# EAGLE design USBHostShield-Rev2 (EAGLE 6.4)
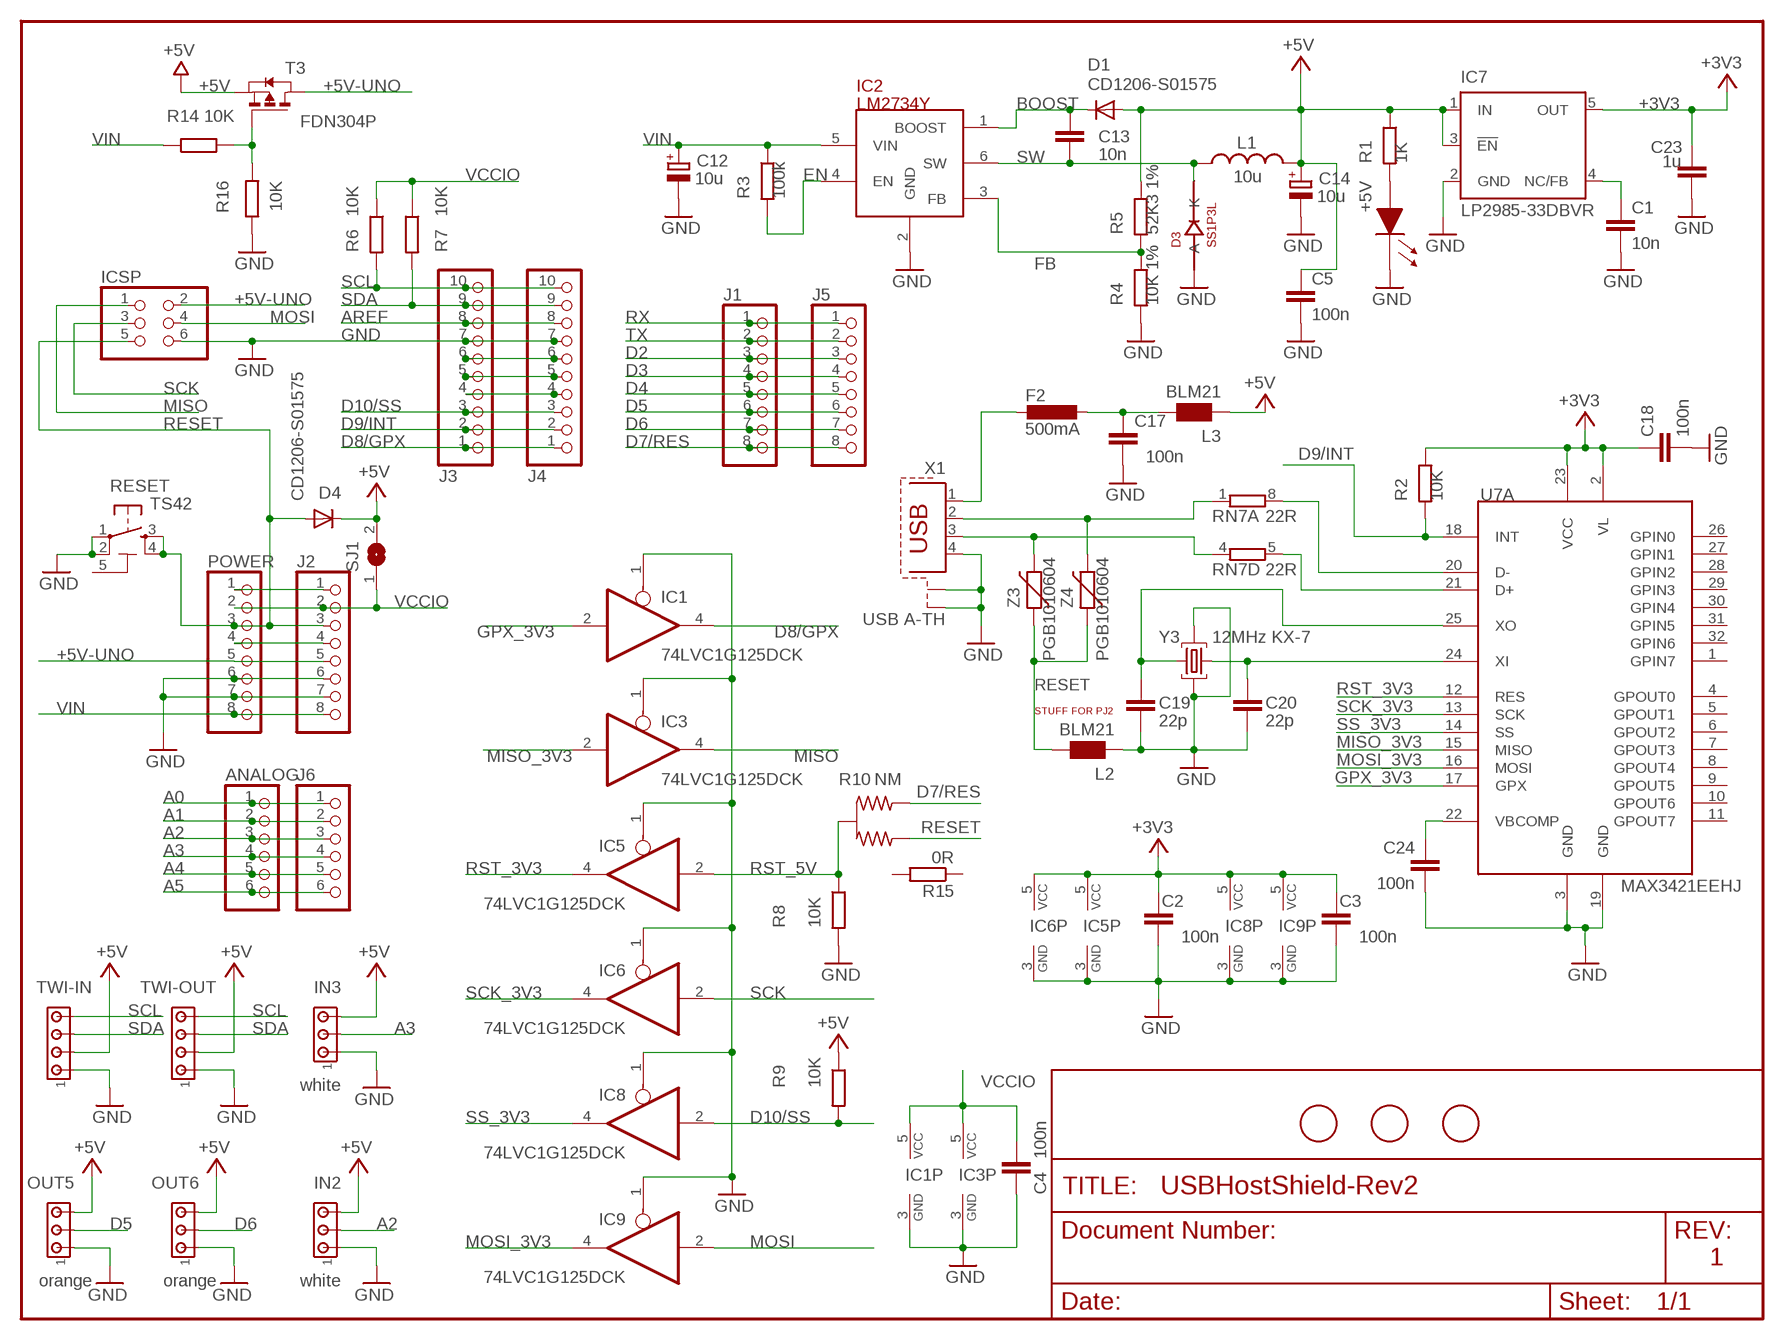
[diagram p0: schematic, sheet 1]

## Parts
+5V  MYSMD_LED0805  [SMD_LED0805]
ANALOG  PINHD-1X6TH  [1X06-TH]
C1  10n  C-EUC0603  [C0603-ROUND]
C2  100n  C-EU0603-RND  [C0603-ROUND]
C3  100n  C-EU0603-RND  [C0603-ROUND]
C4  100n  C-EU0603-RND  [C0603-ROUND]
C5  100n  C-EU0603-RND  [C0603-ROUND]
C12  10u  CPOL-EUSMCB  [SMC_B]
C13  10n  C-EUC0603  [C0603-ROUND]
C14  10u  CPOL-EUSMCB  [SMC_B]
C17  100n  C-EU0603-RND  [C0603-ROUND]
C18  100n  C-EU0603-RND  [C0603-ROUND]
C19  22p  C-EU0603-RND  [C0603-ROUND]
C20  22p  C-EU0603-RND  [C0603-ROUND]
C23  1u  C-EU0603-RND  [C0603-ROUND]
C24  100n  C-EU0603-RND  [C0603-ROUND]
D1  CD1206-S01575  DIODE-MINIMELF  [MINIMELF]
D3  SS1P3L  [DO220AAL]
D4  CD1206-S01575  DIODE-MINIMELF  [MINIMELF]
F2  500mA  L-EUL1812  [L1812]
IC1  74LVC1G125DCK  [SC70-5]
IC2  LM2734Y  LM2736Y  [SOT23-6]
IC3  74LVC1G125DCK  [SC70-5]
IC5  74LVC1G125DCK  [SC70-5]
IC6  74LVC1G125DCK  [SC70-5]
IC7  LP2985-33DBVR  TPS77033  [SOT23-DBV]
IC8  74LVC1G125DCK  [SC70-5]
IC9  74LVC1G125DCK  [SC70-5]
ICSP  PINHD-2X3  [2X03]
IN2  white  0141_LHA-03-TS  [10X03MTA]
IN3  white  0141_LHA-03-TS  [10X03MTA]
J1  PINHD-1X8TH  [1X08-TH]
J2  PINHD-1X8TH  [1X08-TH]
J3  PINHD-1X10TH  [1X10-TH]
J4  PINHD-1X10TH  [1X10-TH]
J5  PINHD-1X8TH  [1X08-TH]
J6  PINHD-1X6TH  [1X06-TH]
L1  10u  L-USSRR0604  [SRR0604]
L2  BLM21  WE-CBF_0805  [0805]
L3  BLM21  WE-CBF_0805  [0805]
OUT5  orange  0481_LHA-03-TS-P1585C  [10X03MTA]
OUT6  orange  0481_LHA-03-TS-P1585C  [10X03MTA]
POWER  PINHD-1X8TH  [1X08-TH]
R1  1K  R-EU_0603-RND  [R0603-ROUND]
R2  10K  R-EU_0603-RND  [R0603-ROUND]
R3  100k  R-EU_0603-RND  [R0603-ROUND]
R4  10K 1%  R-EU_0603-RND  [R0603-ROUND]
R5  52K3 1%  R-EU_0603-RND  [R0603-ROUND]
R6  10K  R-EU_0603-RND  [R0603-ROUND]
R7  10K  R-EU_0603-RND  [R0603-ROUND]
R8  10K  R-EU_0603-RND  [R0603-ROUND]
R9  10K  R-EU_0603-RND  [R0603-ROUND]
R10  NM  J0402  [J0402]
R14  10K  R-EU_0603-RND  [R0603-ROUND]
R15  0R  R-EU_R0402  [R0402]
R16  10K  R-EU_0603-RND  [R0603-ROUND]
RESET  TS42  [TS42]
RN7  22R  4R-NCAY16  [CAY16]
SJ1  SJ  [SJ]
T3  FDN304P  PMOSSOT23  [SOT-23]
TWI-IN  0205_LHA-04-TS__4X1_VERTICALE_BIANCO_P_2,54  [10X04MTA]
TWI-OUT  0205_LHA-04-TS__4X1_VERTICALE_BIANCO_P_2,54  [10X04MTA]
U7A  MAX3421EEHJ  [TQFP32-05]
U$1  FIDUCIALMOUNT  [FIDUCIA-MOUNT]
U$3  FIDUCIALMOUNT  [FIDUCIA-MOUNT]
U$6  FIDUCIALMOUNT  [FIDUCIA-MOUNT]
X1  USB A-TH  PN87520-S  [PN87520-S]
Y3  12MHz KX-7  CRYSTAL-3.2-2.5  [CRYSTAL-3.2-2.5]
Z3  PGB1010604  VARISTORCN0603  [CT/CN0603]
Z4  PGB1010604  VARISTORCN0603  [CT/CN0603]

## Nets
+3V3 [power]: C2.1 C3.1 C18.1 C23.2 IC5.5(VCC) IC6.5(VCC) IC7.5(OUT) IC8.5(VCC) IC9.5(VCC) R2.1 U7A.2(VL) U7A.23(VCC)
+5V [+5v]: C5.1 C14.+ D1.A D4.C IC7.1(IN) IC7.3(!EN) IN2.3 IN3.3 L1.P$2 L3.1 OUT5.3 OUT6.3 R1.1 R5.1 R9.1 SJ1.2 T3.2(S) TWI-IN.2 TWI-OUT.2
+5V-UNO [power]: ICSP.2 J2.5 POWER.5 T3.1(D)
A0: ANALOG.1 J6.1
A1: ANALOG.2 J6.2
A2: ANALOG.3 IN2.2 J6.3
A3: ANALOG.4 IN3.2 J6.4
A4: ANALOG.5 J6.5
A5: ANALOG.6 J6.6
AREF: J3.8 J4.8
BOOST: C13.1 D1.C IC2.1(BOOST)
D2: J1.3 J5.3
D3: J1.4 J5.4
D4: J1.5 J5.5
D5: J1.6 J5.6 OUT5.2
D6: J1.7 J5.7 OUT6.2
D7/RES: J1.8 J5.8 R10.1
D8/GPX: IC1.4(O) J3.1 J4.1
D9/INT: J3.2 J4.2 R2.2 U7A.18(INT)
D10/SS: IC8.2(I) J3.3 J4.3 R9.2
EN: IC2.4(EN) R3.2
FB: IC2.3(FB) R4.1 R5.2
GND [gnd]: +5V.1(CA) C1.2 C2.2 C3.2 C4.2 C5.2 C12.- C14.- C17.2 C18.2 C19.1 C20.1 C23.1 C24.2 D3.P$2(A) IC1.1(OE) IC1.3(GND) IC2.2(GND) IC3.1(OE) IC3.3(GND) IC5.1(OE) IC5.3(GND) IC6.1(OE) IC6.3(GND) IC7.2(GND) IC8.1(OE) IC8.3(GND) IC9.1(OE) IC9.3(GND) ICSP.6 IN2.1 IN3.1 J2.6 J2.7 J3.7 J4.7 L2.1 OUT5.1 OUT6.1 POWER.6 POWER.7 R4.2 R8.2 R16.1 RESET.1 RESET.2 TWI-IN.1 TWI-OUT.1 U7A.3(GND) U7A.19(GND) X1.4 X1.S1 X1.S2 Y3.2(GND) Y3.4(GND)
GPX_3V3: IC1.2(I) U7A.17(GPX)
MISO: IC3.4(O) ICSP.1
MISO_3V3: IC3.2(I) U7A.15(MISO)
MOSI: IC9.2(I) ICSP.4
MOSI_3V3: IC9.4(O) U7A.16(MOSI)
N$1: C1.1 IC7.4(NC/FB)
N$2: +5V.2(AN) R1.2
N$3: L2.2 Z3.1 Z4.1
N$4: R14.2 R16.2 T3.3(G)
N$5 [power]: J2.4 POWER.4
N$14: J3.4 J4.4
N$15: J3.5 J4.5
N$16: J3.6 J4.6
N$26: RN7.1 X1.2 Z4.2
N$27: RN7.4 X1.3 Z3.2
N$28: RN7.8 U7A.20(D-)
N$29: RN7.5 U7A.21(D+)
N$30: C20.2 U7A.24(XI) Y3.1(C1)
N$31: C19.2 U7A.25(XO) Y3.3(C2)
N$32 [power usb]: F2.2 X1.1
N$33 [power usb]: C17.1 F2.1 L3.2
N$35: J2.1 POWER.1
N$39: C24.1 U7A.22(VBCOMP)
RESET: D4.A ICSP.5 J2.3 POWER.3 R10.3 RESET.3 RESET.4
RST_3V3: IC5.4(O) U7A.12(RES)
RST_5V: IC5.2(I) R8.1 R10.2(C)
RX: J1.1 J5.1
SCK: IC6.2(I) ICSP.3
SCK_3V3: IC6.4(O) U7A.13(SCK)
SCL: J3.10 J4.10 R6.2 TWI-IN.4 TWI-OUT.4
SDA: J3.9 J4.9 R7.2 TWI-IN.3 TWI-OUT.3
SS_3V3: IC8.4(O) U7A.14(SS)
SW [power]: C13.2 D3.P$1(K) IC2.6(SW) L1.P$1
TX: J1.2 J5.2
VCCIO: C4.1 IC1.5(VCC) IC3.5(VCC) J2.2 POWER.2 R6.1 R7.1 SJ1.1
VIN: C12.+ IC2.5(VIN) J2.8 POWER.8 R3.1 R14.1
Unconnected: R15.1 R15.2 RN7.2 RN7.3 RN7.6 RN7.7 U7A.1(GPIN7) U7A.4(GPOUT0) U7A.5(GPOUT1) U7A.6(GPOUT2) U7A.7(GPOUT3) U7A.8(GPOUT4) U7A.9(GPOUT5) U7A.10(GPOUT6) U7A.11(GPOUT7) U7A.26(GPIN0) U7A.27(GPIN1) U7A.28(GPIN2) U7A.29(GPIN3) U7A.30(GPIN4) U7A.31(GPIN5) U7A.32(GPIN6)

## Notes on the sheet
- STUFF FOR PJ2
- 1

## Power pins joined to a net without a drawn wire
5-GND: RESET.5(5-GND)

## Library data of the parts
+5V = SmartPrj:MYSMD_LED0805
ANALOG J6 = SmartPrj:PINHD-1X6: PIN HEADER
C1-C5 C13 C17-C20 C23 C24 = SmartPrj:C-EU: CAPACITOR, European symbol
C12 C14 = rcl:CPOL-EU: POLARIZED CAPACITOR, European symbol
D1 D4 = diode:DIODE-: DIODE
D3 = SmartPrj:SS1P3L
F2 = rcl:L-EU: INDUCTOR, European symbol
IC1 IC3 IC5 IC6 IC8 IC9 = 74xx-little-us:74*1G125: Single Bus Buffer Gate with 3-State Output
IC2 = SmartPrj:LM2736Y
IC7 = texas:TPS770*: ULTRALOW-POWER 50-mA LOW-DROPOUT LINEAR REGULATORS 50-mA Low-Dropout Regulator Source: http://focus.ti.com/lit/ds/symlink/tps77001.pdf
ICSP = SmartPrj:PINHD-2X3: PIN HEADER
IN2 IN3 = Connettori:0141_LHA-03-TS: 3x1 V Bianco P2,54; MONTHLY_USAGE: _____; PART_NUMBER: LHA-03-TS; PRICE: _____; SUPPLIER: _____; TYPE: Connettori
J1 J2 J5 POWER = SmartPrj:PINHD-1X8: PIN HEADER
J3 J4 = SmartPrj:PINHD-1X10: PIN HEADER
L1 = SmartPrj:L-US: INDUCTOR, American symbol
L2 L3 = wuerth-elektronik:WE-CBF: SMD EMI Suppression Ferrite Beads - excellent anti-EMI properties - low DCR - impedances till 3000 ohms - rated current up to 6 A
OUT5 OUT6 = Connettori:0481_LHA-03-TS-P1585C: 3x1 Poli V Arancioni; MONTHLY_USAGE: _____; PART_NUMBER: LHA-03-TS-P1585C; PRICE: _____; SUPPLIER: _____; TYPE: Connettori; VALUE: LHA-03-TS-P1585C
R1-R9 R14-R16 = SmartPrj:R-EU_: RESISTOR, European symbol
R10 = bibaja:J: Three terminal jumper made from two 0402, 0603, 0805, etc.
RESET = SmartPrj:TS42: TS42 Dongnan Electronics Tact switch VDC 12V - 50mA
RN7 = resistor-dil:4R-N: Array Chip Resistor Source: RS Component / Phycomp
SJ1 = SmartPrj:SJ: SMD solder JUMPER
T3 = zetex:PMOSSOT23: MOS FET
TWI-IN TWI-OUT = Connettori:0205_LHA-04-TS__4X1_VERTICALE_BIANCO_P_2,54: 4x1 V Bianco p 2,54; MONTHLY_USAGE: _____; PART_NUMBER: LHA-04-TS__4x1_Verticale_Bianco_p_2,54; PRICE: _____; SUPPLIER: _____; TYPE: Connettori
U7A = bibaja:MAX3421EE: MAX3421 SPI to USB Interface Chip
U$1 U$3 U$6 = SmartPrj:FIDUCIALMOUNT
X1 = SmartPrj:PN87520-S
Y3 = SmartPrj:CRYSTAL-3.2-2.5
Z3 Z4 = varistor:VARISTOR: VARISTOR

## Net classes
0 default: width 0.229 mm, drill 0.584 mm, clearance 0.203 mm
1 power: width 0.254 mm, drill 0.584 mm, clearance 0.203 mm
2 gnd: width 0.254 mm, drill 0.584 mm, clearance 0.203 mm
3 power usb: width 0.254 mm, drill 0.584 mm, clearance 0.254 mm
4 3v3: width 0.254 mm, drill 0.584 mm, clearance 0.203 mm
5 +5v: width 0.254 mm, drill 0.584 mm, clearance 0.203 mm

## Board
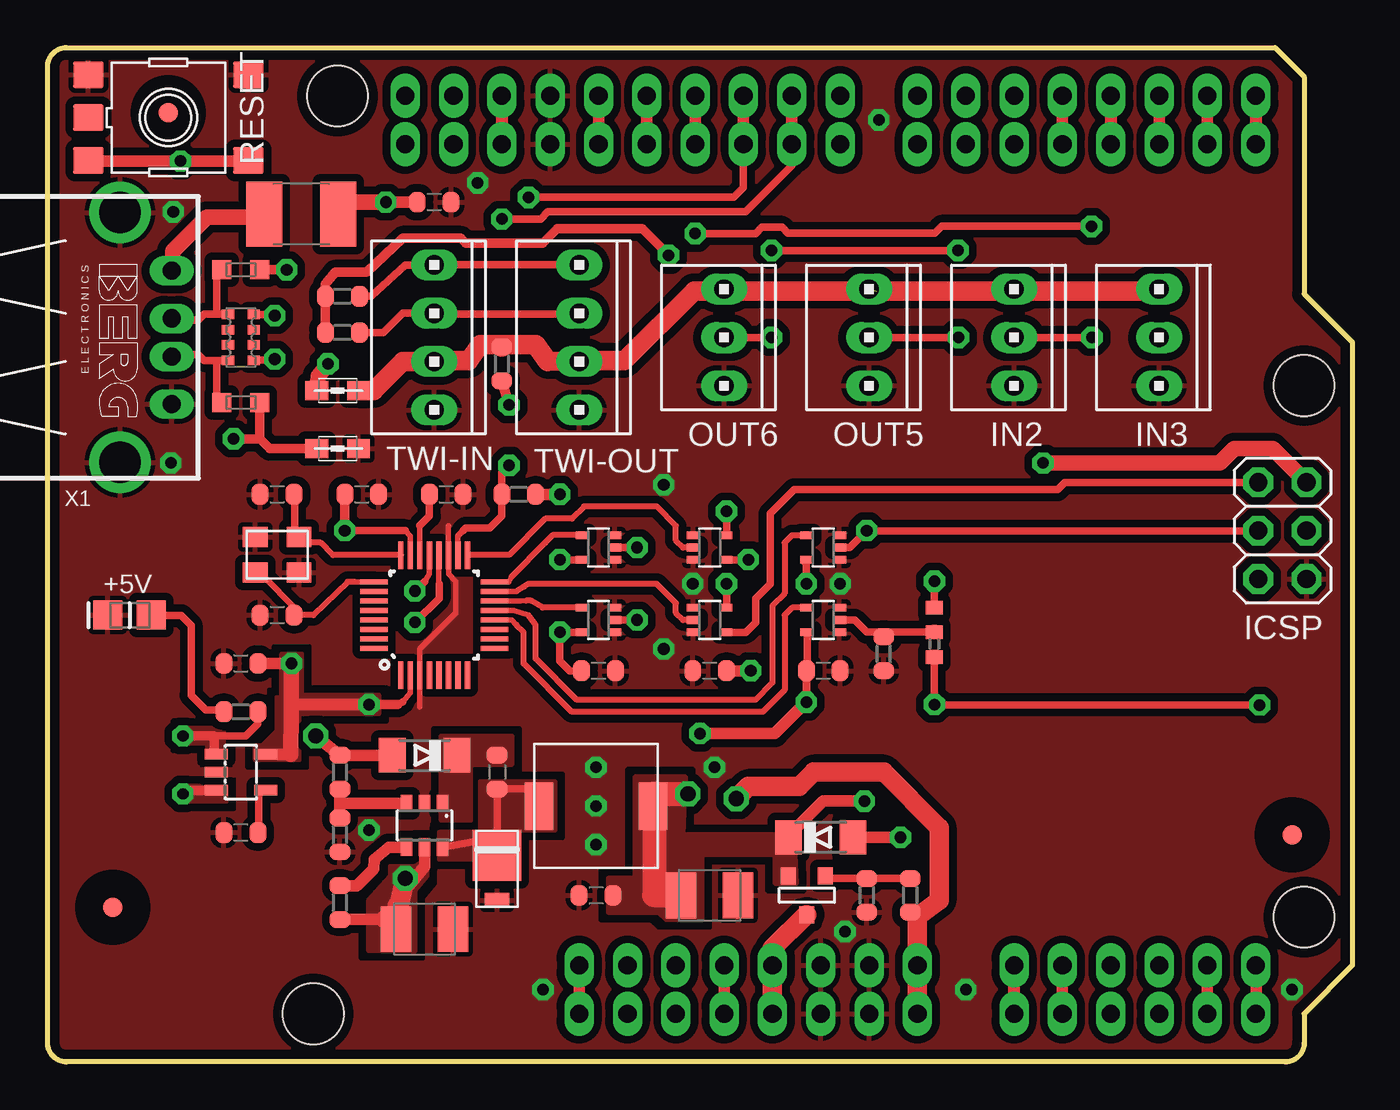
[diagram p1: board, top side]
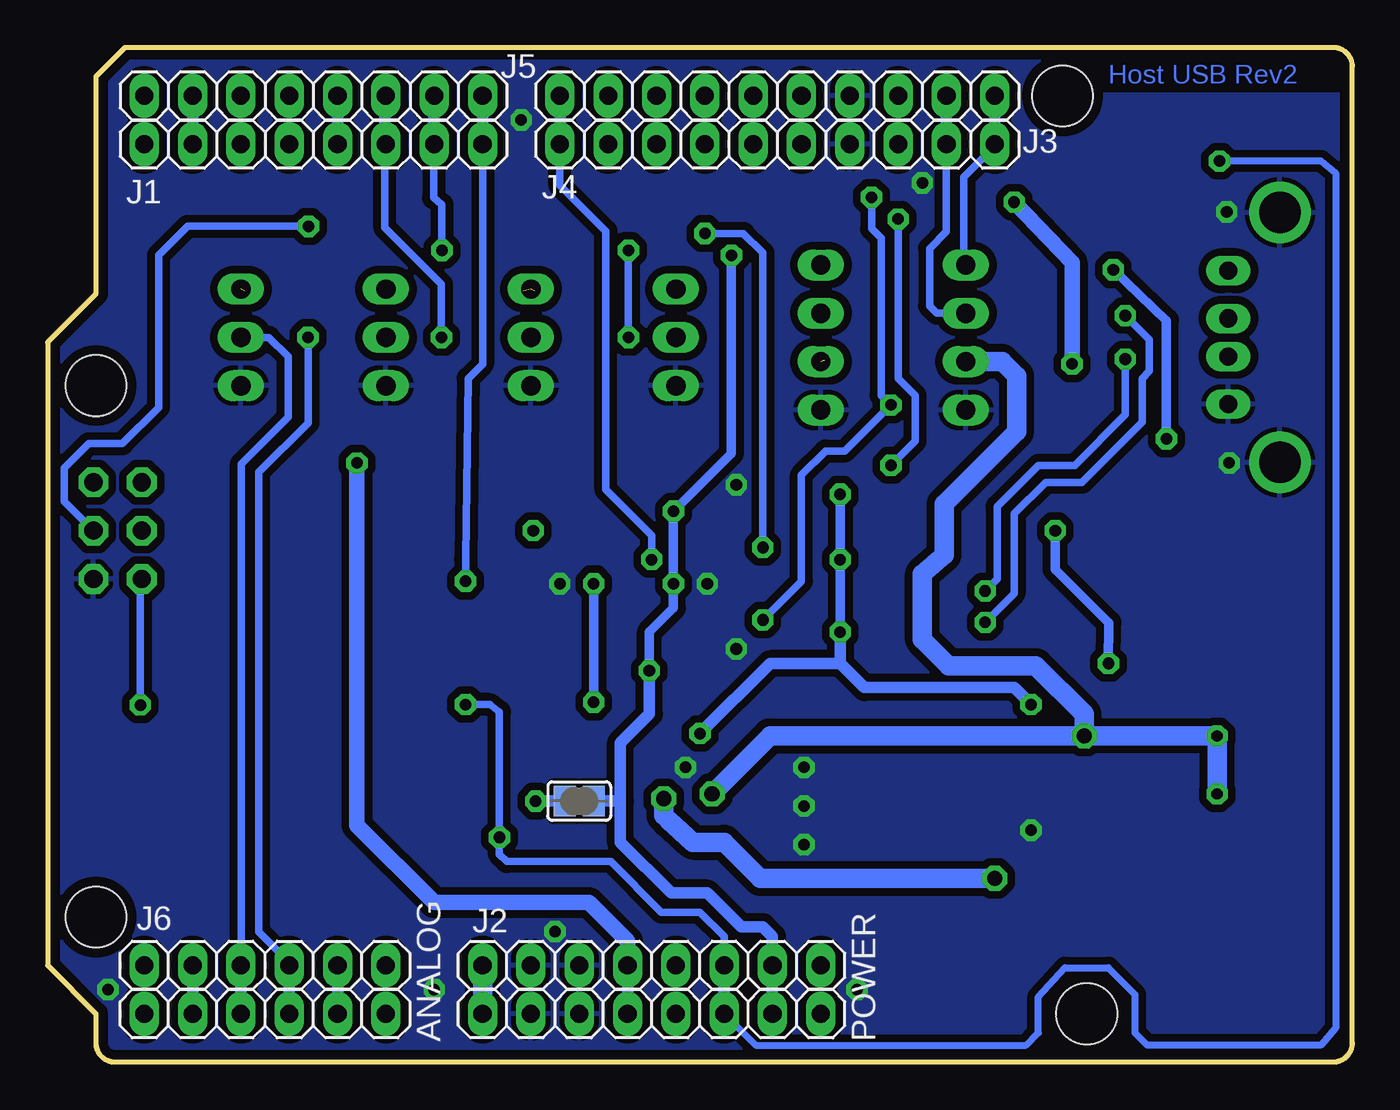
[diagram p2: board, bottom side, seen from below]

Size 68.58 x 53.34 mm. Coordinates in mm from the lower left corner, seen from the top.
Outline: 64.52,53.34 66.04,51.82 66.04,40.39 68.58,37.85 68.58,5.08 66.04,2.54 66.04,1 arc-90 65.04,0 1,0 arc-90 0,1 0,52.34 arc-90 1,53.34 64.52,53.34
Copper layers (1*16): Top 0.035mm / dielectric 1.5mm / Bottom 0.035mm
Design rules "default *": minimum track width 10mil, minimum drill 23mil, track to track 8mil, track to pad 8mil, pad to pad 8mil, via to via 8mil, smd to smd 8mil, copper to edge 20mil, drill to drill 8mil, minimum pad ring 12mil, minimum via ring 10mil, stop-mask expansion 2mil, vias tented up to drill 24mil, thermal gap 10mil
Holes 3.2 mm at 15.24,50.8 66.04,7.62 66.04,35.56 13.97,2.54
bRestrict: 1 lines

### Footprints (pad centres in the part's own frame; a part is rotated, then mirrored left to right if it is on the bottom)
SMD_LED0805 = smd 1.524 x 1.524: 1 0,0; 2 2.286,0
1X06-TH = drill 0.95 pad 1.422 long: 1 -6.35,0; 2 -3.81,0; 3 -1.27,0; 4 1.27,0; 5 3.81,0; 6 6.35,0
C0603-ROUND = smd 0.898 x 1.1: 1 -0.889,0; 2 0.889,0
SMC_B = smd 1.6 x 2.4: + -1.5,0; - 1.5,0
MINIMELF = smd 1.4 x 1.8: A 1.7,0; C -1.7,0
DO220AAL = smd 2.667 x 2.54: P$1 -0.7,0 | smd 0.762 x 1.27: P$2 1.65,0
L1812 = smd 1.9 x 3.4: 1 -1.95,0; 2 1.95,0
SC70-5 = smd 0.4 x 0.7: 1 -0.65,-0.85; 2 0,-0.85; 3 0.65,-0.85; 4 0.65,0.85; 5 -0.65,0.85
SOT23-6 = smd 0.6 x 0.9: 1 -0.95,-1.15; 2 0,-1.15; 3 0.95,-1.15; 4 0.95,1.15; 5 0,1.15; 6 -0.95,1.15
SOT23-DBV = smd 0.55 x 1.2: 1 -0.95,-1.3; 2 0,-1.3; 3 0.95,-1.3; 4 0.95,1.3; 5 -0.95,1.3
2X03 = drill 0.95 pad 1.55 octagon: 1 -2.54,-1.27; 2 -2.54,1.27; 3 0,-1.27; 4 0,1.27; 5 2.54,-1.27; 6 2.54,1.27
10X03MTA = drill 1.016 long: 1 2.54,0; 2 0,0; 3 -2.54,0
1X08-TH = drill 0.95 pad 1.422 long: 1 -8.89,0; 2 -6.35,0; 3 -3.81,0; 4 -1.27,0; 5 1.27,0; 6 3.81,0; 7 6.35,0; 8 8.89,0
1X10-TH = drill 0.95 pad 1.422 long: 1 -11.43,0; 2 -8.89,0; 3 -6.35,0; 4 -3.81,0; 5 -1.27,0; 6 1.27,0; 7 3.81,0; 8 6.35,0; 9 8.89,0; 10 11.43,0
SRR0604 = smd 1.5 x 2.5: P$1 3,0; P$2 -3,0
0805 = smd 1.2 x 1: 1 -1.1,0; 2 1.1,0
R0603-ROUND = smd 0.898 x 1.1: 1 -0.889,0; 2 0.889,0
J0402 = smd 0.7 x 0.9: 1 -0.65,0; 2 0.65,0; 3 1.95,0
R0402 = smd 0.7 x 0.9: 1 -0.65,0; 2 0.65,0
TS42 = smd 1.6 x 1.4: 1 -4.2,2.25; 2 4.2,2.25; 3 -4.2,-2.25; 4 4.2,-2.25; 5 -4.2,0
CAY16 = smd 0.5 x 0.65: 1 -1.2,-0.675; 2 -0.4,-0.675; 3 0.4,-0.675; 4 1.2,-0.675; 5 1.2,0.675; 6 0.4,0.675; 7 -0.4,0.675; 8 -1.2,0.675
SJ = smd 1.168 x 1.6: 1 -0.762,0; 2 0.762,0
SOT-23 = smd 0.787 x 0.889: 1 0.025,-1.016; 2 -0.94,1.016; 3 0.991,1.016
10X04MTA = drill 1.016 long: 1 3.81,0; 2 1.27,0; 3 -1.27,0; 4 -3.81,0
TQFP32-05 = smd 0.27 x 1.45: 1 -1.75,-3.16; 2 -1.25,-3.16; 3 -0.75,-3.16; 4 -0.25,-3.16; 5 0.25,-3.16; 6 0.75,-3.16; 7 1.25,-3.16; 8 1.75,-3.16; 17 1.75,3.16; 18 1.25,3.16; 19 0.75,3.16; 20 0.25,3.16; 21 -0.25,3.16; 22 -0.75,3.16; 23 -1.25,3.16; 24 -1.75,3.16 | smd 1.45 x 0.27: 9 3.16,-1.75; 10 3.16,-1.25; 11 3.16,-0.75; 12 3.16,-0.25; 13 3.16,0.25; 14 3.16,0.75; 15 3.16,1.25; 16 3.16,1.75; 25 -3.16,1.75; 26 -3.16,1.25; 27 -3.16,0.75; 28 -3.16,0.25; 29 -3.16,-0.25; 30 -3.16,-0.75; 31 -3.16,-1.25; 32 -3.16,-1.75
FIDUCIA-MOUNT = smd 1.016 x 1.016: P$1 0,0
PN87520-S = drill 0.95 long: 1 -3.5,2.71; 2 -1,2.71; 3 1,2.71; 4 3.5,2.71 | drill 2.2 pad 2.9: S1 -6.57,0; S2 6.57,0
CRYSTAL-3.2-2.5 = smd 1.3 x 1.05: 1 -1.15,-0.925; 2 1.15,-0.925; 3 1.15,0.925; 4 -1.15,0.925
CT/CN0603 = smd 1 x 1: 1 -1,0; 2 1,0

### Placement (x,y rotation side)
+5V  3.17,23.5 0 top
ANALOG  57.15,2.54 180 bottom
C1  10.16,12.06 180 top
C2  28.96,20.57 0 top
C3  40.77,20.57 0 top
C4  34.8,20.57 180 top
C5  28.83,8.76 180 top
C12  19.81,6.99 0 top
C13  23.62,15.24 270 top
C14  34.8,8.76 0 top
C17  20.32,45.21 0 top
C18  16.51,29.84 0 top
C19  12.06,23.5 0 top
C20  12.06,29.84 0 top
C23  10.16,20.95 0 top
C24  20.95,29.84 0 top
D1  19.81,16.13 180 top
D3  23.62,10.16 270 top
D4  40.64,11.81 0 top
F2  13.34,44.58 180 top
IC1  34.8,27.05 270 top
IC2  19.81,12.45 180 top
IC3  34.8,23.24 270 top
IC5  40.77,23.24 90 top
IC6  40.77,27.05 90 top
IC7  10.16,15.24 270 top
IC8  28.96,23.24 90 top
IC9  28.96,27.05 90 top
ICSP  64.9,27.94 270 top
IN2  50.8,38.1 270 top
IN3  58.42,38.1 270 top
J1  54.61,50.8 0 bottom
J2  36.83,5.08 180 bottom
J3  30.23,50.8 0 bottom
J4  30.23,48.26 0 bottom
J5  54.61,48.26 0 bottom
J6  57.15,5.08 180 bottom
L1  28.83,13.46 180 top
L2  15.24,32.26 180 top
L3  15.24,35.31 180 top
OUT5  43.18,38.1 270 top
OUT6  35.56,38.1 270 top
POWER  36.83,2.54 180 bottom
R1  10.16,18.41 180 top
R2  24.77,29.84 180 top
R3  15.37,8.38 90 top
R4  15.37,11.94 270 top
R5  15.37,15.24 270 top
R6  15.49,40.26 0 top
R7  15.49,38.35 0 top
R8  43.94,21.46 270 top
R9  23.88,36.7 270 top
R10  46.61,23.24 270 top
R14  45.34,8.76 90 top
R15  46.61,21.97 90 top
R16  43.05,8.76 90 top
RESET  6.35,49.66 0 top
RN7  10.16,38.1 270 top
SJ1  40.64,13.72 180 bottom
T3  39.88,8.76 0 top
TWI-IN  20.32,38.1 270 top
TWI-OUT  27.94,38.1 270 top
U7A  20.32,23.5 0 top
U$1  65.41,11.94 0 top
U$3  3.43,8.13 0 top
U$6  6.35,49.91 0 top
X1  3.81,38.1 270 top
Y3  12.06,26.67 180 top
Z3  10.16,34.67 180 top
Z4  10.16,41.66 180 top

### Tracks (layer width: path | path; a pad name or v marks a point on that pad's centre or on a via)
+3V3  (via drill 0.61)
  Top 0.279: U7A.23 19.07,27.67 18.8,27.94 | U7A.2 19.07,19.4 18.67,18.92
  Top 0.406: 15.49,29.87 15.49,29.9 15.54,29.97 15.54,29.87 C18.1 | 11.2,16.18 IC7.5 | C23.2 11.28,20.98 11.3,20.95 11.18,20.95 | 15.54,29.57 C18.1 | 15.54,29.79 15.54,29.77 | 15.54,29.77 15.49,29.72 | 15.54,29.77 C18.1 | 18.8,27.94 v15.62,27.94 | 18.67,18.92 18.41,18.8 | v12.83,20.95 12.7,20.95 | IC9.5 27.07,26.4 v26.92,26.42 | IC8.5 27.19,22.59 v26.92,22.61 26.92,21.08 27.43,20.57 C2.1 | v39.88,25.15 39.88,26.29 39.79,26.29 IC6.5 | IC5.5 39.92,21.21 v39.88,18.92 C3.1
  Top 0.508: v15.62,27.94 C18.1 | v16.89,18.8 18.41,18.8
  Top 0.61: 12.78,16.18 11.2,16.18 | 11.3,20.95 v12.83,20.95 12.83,18.8 v16.89,18.8 | R2.1 v26.92,29.84 | v39.88,18.92 38.23,17.27 v34.29,17.27
  Top 0.813: 12.78,16.18 12.8,18.34 12.8,20.93 v12.83,20.95
  Bottom 0.508: v39.88,25.15 v39.88,18.92 | v26.92,22.61 v26.92,26.42 v26.92,29.84 | v12.83,20.95 12.8,23.09 15.62,25.91 v15.62,27.94
  Bottom 0.61: v26.92,22.61 26.92,20.95 | 26.92,20.95 30.61,20.95 v34.29,17.27 | v16.89,18.8 17.78,19.68 25.65,19.68 26.92,20.95
  pour Top (isolate 0.406, no thermals): 13.34,21.46 13.34,19.3 17.4,19.3 17.4,18.29 13.21,18.29 13.21,15.88 10.92,15.88 10.92,16.64 11.3,16.64 12.06,17.4 12.06,19.18 12.32,19.18 12.32,21.46
+5V  (via drill 0.6, 0.61, 0.8)  (5 unrouted)
  Top 0.406: R1.1 11.05,17.78 10.41,17.14 8.76,17.14 | IC7.1 8.86,16.23 8.76,16.26 | 7.3,14.29 v7.11,14.1
  Top 0.508: 8.84,14.28 IC7.3 7.3,14.29 | 8.76,16.26 8.76,17.14 v7.11,17.14
  Top 0.61: v42.93,13.72 40.77,13.72 38.86,11.81 38.99,11.81 | D1.A R5.1 v14.1,17.14
  Top 1.016: 42.98,40.54 35.66,40.54 | 27.84,36.88 30.3,36.88 33.98,40.54 35.05,40.54 | 58.22,40.54 50.9,40.54 | 50.29,40.54 43.59,40.54 | 24,37.72 22.73,37.72 22.15,36.88 20.33,36.88 TWI-IN.2 20.32,36.88 19.54,36.88 19.49,36.83 18.67,36.83 17.14,35.31 L3.1 | 24,37.72 25.65,37.72 26.29,36.83 27.74,36.88 | R9.1 24,37.72
  Top 1.27: 58.83,40.54 IN3.3 | 35.66,40.54 OUT6.3 35.05,40.54 | 50.9,40.54 IN2.3 50.29,40.54 | C14.+ 31.88,8.76 31.88,14.1 v33.66,14.1
  Bottom 0.61: SJ1.2 v42.93,13.72
  Bottom 1.016: v14.1,17.14 v7.11,17.14 v7.11,14.1 | v14.1,17.14 14.1,18.29 16.64,20.83 21.21,20.83 22.61,22.23 22.61,25.65 21.46,26.67 21.46,29.34 17.65,33.15 17.65,36.07 18.41,36.83 TWI-IN.2 | v33.66,14.1 30.61,17.14 v14.1,17.14
  pour Top (isolate 0.406, no thermals): 34.42,7.49 34.42,10.92 38.23,10.92 38.23,9.4 39.37,9.4 39.24,11.94 33.4,11.94 33.53,14.99 30.86,14.99 30.86,9.65 29.46,9.65 29.46,7.87 32.13,7.87 32.51,7.49
  pour Top (isolate 0.406, no thermals): 9.4,14.48 7.37,14.48 7.37,13.72 9.4,13.72
  pour Top (isolate 0.406, no thermals): 9.27,17.53 6.99,17.53 6.99,16.76 8.38,16.76 8.38,16.13 9.27,16.13
+5V-UNO  (via drill 0.61)
  Top 0.813: ICSP.2 64.39,32.26 62.36,32.26 61.59,31.5 v52.32,31.5
  Top 1.016: POWER.5 J2.5 38.1,5.97 39.88,7.75 T3.1
  Bottom 0.61: J2.5 POWER.5
  Bottom 0.813: v52.32,31.5 52.32,12.45 48.26,8.38 40.13,8.38 38.1,6.35 J2.5
A0
  Top 0.406: 50.77,4.75 J6.1 | 50.77,2.62 ANALOG.1
  Top 0.61: 50.77,2.62 50.77,4.75 | J6.1 50.8,2.41
A1
  Top 0.61: J6.2 53.34,2.41
  Bottom 0.61: ANALOG.2 J6.2
A2  (via drill 0.61)
  Top 0.406: v54.89,38.1 IN2.2
  Bottom 0.406: v54.89,38.1 54.89,33.6 57.48,31.01 57.48,6.83 55.78,5.13 | 55.78,5.18 55.78,5.13 | 55.78,5.13 55.83,5.13 J6.3
  Bottom 0.61: J6.3 ANALOG.3
A3
  Bottom 0.406: IN3.2 56.95,38.1 55.93,37.08 55.93,33.91 58.4,31.45 58.4,5.11 J6.4
  Bottom 0.61: J6.4 ANALOG.4
A4
  Top 0.61: J6.5 ANALOG.5
  Bottom 0.61: ANALOG.5 J6.5
A5
  Top 0.406: 63.52,4.88 J6.6 | 63.52,2.74 ANALOG.6
  Top 0.61: 63.52,2.74 63.52,4.88
AREF
  Top 0.406: 23.9,50.6 J3.8 | 23.9,48.46 J4.8
  Top 0.61: 23.9,48.46 23.9,50.6 | J3.8 J4.8
BOOST
  pour Top (no thermals): 20.7,17.14 24.38,17.14 24.38,15.62 22.23,15.62 22.23,12.7 20.7,12.7
D2
  Top 0.61: J5.3 J1.3
D3
  Top 0.406: 55.91,50.6 J1.4 | 55.91,48.46 J5.4
  Top 0.61: 55.91,48.46 55.91,50.6 | J1.4 J5.4
D4
  Top 0.61: J1.5 53.34,48.13
  Bottom 0.61: J5.5 J1.5
D5  (via drill 0.61)
  Top 0.406: v47.88,38.1 OUT5.2
  Bottom 0.406: v47.88,38.1 47.88,40.89 50.85,43.87 50.85,48.21
  Bottom 0.61: 50.85,48.21 50.85,48.39 | 50.85,48.39 50.85,50.75 J1.6 | J5.6 50.8,48.34 50.85,48.39
D6  (via drill 0.61)
  Top 0.406: v38.05,38.1 OUT6.2 | v47.85,42.67 v38.05,42.67
  Bottom 0.406: v38.05,42.67 v38.05,38.1 | v47.85,42.67 47.9,42.72 47.9,42.77 47.88,42.8 47.85,42.8 47.85,45.09 48.28,45.44 48.28,48.21
  Bottom 0.61: 48.28,48.21 48.28,48.28 | 48.28,48.28 48.28,50.83 | 48.28,50.85 48.28,50.83 | 48.28,50.83 J1.7 | 48.28,48.28 J5.7
D7/RES  (via drill 0.61)
  Top 0.406: R10.1 v46.61,25.27
  Bottom 0.406: J5.8 45.72,36.7 46.48,35.94 46.61,26.47 v46.61,25.27
  Bottom 0.61: J5.8 J1.8 45.72,48.13
D8/GPX  (via drill 0.61)
  Top 0.406: IC1.4 36.83,26.4 v36.83,26.42
  Bottom 0.406: v36.83,26.42 36.83,27.69 39.24,30.1 39.24,43.69 41.66,46.1 41.66,48.01 41.68,48.16 41.63,48.16
  Bottom 0.61: 41.63,48.08 41.63,48.16 | 41.63,48.16 41.63,50.77 J3.1 | 41.63,48.16 41.66,48.13 J4.1
D9/INT  (via drill 0.61)
  Top 0.279: U7A.18 21.57,27.67 21.84,27.94
  Top 0.406: 39.14,48.11 J4.2 39.12,47.12 36.7,44.7 26.29,44.7 25.91,44.32 v23.88,44.32 | 21.84,27.94 21.97,28.07 23.24,28.07 23.88,28.7 R2.2 23.88,30.99 v24.26,31.37
  Top 0.61: J3.2 J4.2
  Bottom 0.406: v24.26,31.37 22.99,32.64 22.99,35.05 23.88,35.94 v23.88,44.32
D10/SS  (via drill 0.61)
  Top 0.406: J4.3 36.58,45.97 36.07,45.47 v25.27,45.47 | IC8.2 v30.99,23.24
  Top 0.508: R9.2 v24.26,34.54
  Top 0.61: J4.3 J3.3
  Bottom 0.406: v25.27,45.47 25.27,43.81 24.77,43.31 24.77,35.05 v24.26,34.54 26.67,32.13 27.69,32.13 28.96,30.86 28.96,25.27 v30.99,23.24
EN
  Top 0.61: IC2.4 17.92,11.29 17.16,10.66 17.14,10.16 16.26,9.27 R3.2
FB
  Top 0.61: R4.1 R5.2 15.36,13.6 18.8,13.59 18.86,13.52 IC2.3
GND  (via drill 0.61)
  Top 0.279: U7A.19 21.07,28.18 21.08,28.19 | 21.08,26.67 21.08,25.65 21.46,25.27 21.46,23.62 19.56,21.72 U7A.3 19.56,20.32 19.56,18.67 19.57,18.68
  other vias: 33.91,25.15 41.66,25.15 32.38,21.72 43.69,49.53 22.61,46.23 48.26,3.81 6.48,31.5 6.6,44.7 28.83,13.46 16.89,12.19 28.83,15.49 28.83,11.43 65.41,3.81 26.04,3.81 35.05,15.49 32.38,30.35 41.91,6.86
  pour Top (isolate 0.406, rank 2): -1.91,55.24 70.48,55.24 70.87,-1.14 -1.52,-1.14
  pour Bottom (isolate 0.406, rank 2): -1.27,54.61 69.85,54.61 69.85,-1.27 -1.27,-1.27
  pour Top (isolate 0.406, rank 2, no thermals): 9.91,15.37 7.87,15.37 7.87,15.11 9.91,15.11
  pour Top (isolate 0.406, no thermals): 19.99,14.61 19.63,14.61 19.63,12.45 19.99,12.45
GPX_3V3
  Top 0.254: 22.1,26.67 U7A.17
  Top 0.305: IC1.2 33.4,27.05 33.02,27.43 33.02,28.19 32,29.21 28.19,29.21 27.56,28.57 26.16,28.57 24.26,26.67 22.1,26.67
MISO
  Top 0.406: ICSP.1 53.47,30.48 53.09,30.1 39.24,30.1 37.97,28.83 37.97,25.15 37.21,24.38 37.21,23.11 36.69,22.59 IC3.4
MISO_3V3
  Top 0.279: 24.64,24.74 U7A.15
  Top 0.305: IC3.2 33.4,23.24 33.02,23.62 33.02,24.13 32,25.15 25.27,25.15 25.04,24.99 24.64,24.74
MOSI  (via drill 0.61)
  Top 0.406: v54.86,43.94 46.99,43.94 46.63,43.59 38.91,43.59 38.61,43.89 37.54,43.89 37.21,43.56 v34.04,43.56 | IC9.2 v30.99,27.05
  Bottom 0.406: ICSP.4 67.69,29.46 67.69,31.24 66.42,32.51 64.64,32.51 62.74,34.42 62.74,42.42 61.21,43.94 v54.86,43.94 | v30.99,27.05 30.99,42.55 32,43.56 v34.04,43.56
MOSI_3V3
  Top 0.279: U7A.16 24.23,25.25 24.38,25.53
  Top 0.305: IC9.4 26.54,27.7 26.16,27.3 24.38,25.53
N$1
  Top 0.406: C1.1 11.1,12.32 11.1,14.15 11.28,14.28 IC7.4
N$2
  Top 0.406: R1.2 9.14,18.59 9.14,18.52 8.31,18.52 7.54,19.28 7.54,22.96 7.04,23.47 5.49,23.47 +5V.2
N$3  (via drill 0.61)
  Top 0.406: 11.15,34.75 Z3.1 11.18,34.54 | Z4.1 11.18,41.53
  Top 0.508: 11.15,32.77 11.15,34.75 | v12.57,41.66 11.3,41.66 | v9.78,32.77 11.15,32.77 | L2.2 11.68,32.26 11.18,32.77 11.15,32.77
  Top 0.61: 11.15,34.75 11.23,34.75 | 11.3,41.66 11.18,41.53
  Bottom 0.508: v9.78,32.77 9.78,38.99 v12.57,41.66
N$4
  Top 0.406: R14.2 R16.2 40.87,9.65 T3.3
N$5
  Top 0.61: J2.4 POWER.4
N$14
  Top 0.61: J4.4 J3.4
N$15
  Top 0.61: J3.5 J4.5
N$16
  Top 0.61: J3.6 J4.6
N$26
  Top 0.406: 8.89,39.32 8.23,39.32 7.92,39.01 6.71,39.01 X1.2 | 8.89,39.32 9.45,39.32 RN7.1 | 8.89,39.32 8.89,41.15 Z4.2
N$27
  Top 0.406: 8.89,36.88 8.23,36.88 7.92,37.19 6.71,37.19 X1.3 | 8.89,36.88 9.45,36.88 RN7.4 | 8.89,36.88 8.89,35.05 Z3.2
N$28  (via drill 0.61)
  Top 0.279: U7A.20 20.57,25.15
  Top 0.406: RN7.8 11.88,39.3 v11.94,39.24 | 20.57,25.15 20.57,24.38 v19.3,23.11
  Bottom 0.406: v11.94,39.24 10.67,37.97 10.67,36.32 11.05,35.94 11.05,33.66 14.22,30.48 16.13,30.48 17.78,28.83 17.78,24.64 v19.3,23.11
N$29  (via drill 0.61)
  Top 0.279: U7A.21 20.07,25.66 19.81,25.27
  Top 0.406: RN7.5 11.63,36.9 v11.94,36.96 | 19.81,25.27 v19.3,24.77
  Bottom 0.406: v19.3,24.77 18.67,25.4 18.67,29.21 16.51,31.37 14.61,31.37 11.94,34.04 v11.94,36.96
N$30
  Top 0.305: U7A.24 15,26.66 14.35,27.3 13.46,27.3 13.21,27.56 13.21,27.59 Y3.1
  Top 0.406: C20.2 12.98,29.57 12.98,27.74 Y3.1
N$31
  Top 0.279: U7A.25 16.1,25.25 16.13,25.25
  Top 0.305: 11.28,25.6 13.08,23.8 13.08,23.62 C19.2 13.97,23.5 15.77,25.25 16.13,25.25
  Top 0.406: 11.28,25.6 10.97,25.6 Y3.3 | 12.98,23.77 C19.2
N$32
  Top 0.61: 10.72,44.42 11.28,44.22 11.28,44.2 F2.2 | 6.58,41.63 X1.1
  Top 0.813: 10.72,44.42 8.36,44.42 6.58,42.65 6.58,41.63
N$33  (via drill 0.61)
  Top 0.61: 14.14,35.22 L3.2 | C17.1 v17.78,45.21 | 15.24,44.96 15.37,45.21 15.37,44.7 15.24,44.58 F2.1
  Top 0.813: v14.73,36.7 14.22,36.07 14.14,35.22 | v17.78,45.21 15.37,45.21
  Bottom 0.813: v14.73,36.7 14.73,42.04 v17.78,45.21
N$35
  Top 0.61: POWER.1 J2.1
N$39
  Top 0.279: U7A.22 19.57,28.21
  Top 0.406: 19.57,28.21 20.07,28.7 C24.1
RESET  (via drill 0.61)
  Top 0.356: 10.55,47.38 RESET.4 10.51,47.37 | RESET.3 2.15,47.38 2.16,47.37
  Top 0.406: v63.7,18.77 46.74,18.77 v46.61,18.8 R10.3
  Top 0.61: 10.51,47.37 v6.99,47.37 2.16,47.37 | D4.A v44.83,11.81
  Bottom 0.356: 63.7,25.3 ICSP.5 | v6.99,47.37 1.65,47.37 0.89,46.74 0.89,1.78 1.65,0.89 10.79,0.89 11.43,1.52 11.43,3.56 12.83,4.95 15.11,4.95 16.51,3.43 16.51,1.52 17.14,0.89 31.37,0.89 POWER.3
  Bottom 0.406: 33.05,4.88 J2.3 33.02,6.6 34.29,7.87 36.32,7.87 38.99,10.54 44.45,10.54 44.83,10.92 v44.83,11.81 44.83,18.41 45.34,18.8 v46.61,18.8 | 33.05,2.74 POWER.3 | 63.7,25.3 v63.7,18.77
  Bottom 0.61: 33.05,2.74 33.05,4.88 | J2.3 33.02,2.41
RST_3V3
  Top 0.279: 24.64,22.99 24.38,23.24 23.5,23.24 U7A.12
  Top 0.305: IC5.4 39.13,23.89 38.73,23.5 38.73,19.56 37.59,18.41 27.56,18.41 25.02,20.95 25.02,22.61 24.64,22.99
RST_5V
  Top 0.406: IC5.2 42.42,23.24 43.05,22.61 43.56,22.61 | 43.56,22.61 46.61,22.61 R10.2 | R8.1 43.69,22.48 43.56,22.61
RX
  Top 0.406: 63.52,50.6 J1.1 | 63.52,48.46 J5.1
  Top 0.61: 63.52,48.46 63.52,50.6 | J1.1 J5.1
SCK  (via drill 0.61)
  Top 0.406: v43.05,27.94 arc-307 43.03,27.91 | 43.03,27.91 63.4,27.91 ICSP.3 | IC6.2 42.16,27.05 42.93,27.81 arc90 43.03,27.91 | v43.05,27.94 arc-307 43.03,27.91 | 43.03,27.91 v43.05,27.94
SCK_3V3
  Top 0.279: 25.27,23.5 24.51,23.75 23.5,23.75 U7A.13
  Top 0.305: IC6.4 39.75,27.69 39.12,27.69 38.73,27.3 38.73,24.64 38.1,24 38.1,19.94 37.21,19.05 27.81,19.05 25.65,21.21 25.65,22.99 25.27,23.5
SCL
  Top 0.406: TWI-OUT.4 27.74,41.94 20.42,41.94 TWI-IN.4 18.8,41.91 17.02,40.26 R6.2
  Bottom 0.406: TWI-IN.4 20.42,42.06 20.42,46.53 18.9,48.06 18.9,48.16 J4.10
  Bottom 0.61: 18.92,50.8 J3.10 J4.10
SDA
  Top 0.406: TWI-OUT.3 27.74,39.32 20.42,39.32 TWI-IN.3 18.67,39.37 17.65,38.35 R7.2
  Bottom 0.406: J4.9 21.34,43.66 22.23,42.77 22.23,39.75 21.84,39.37 TWI-IN.3
  Bottom 0.61: J4.9 J3.9 21.34,48.13
SS_3V3
  Top 0.279: 25.15,24.26 24.84,24.23 23.57,24.23 U7A.14
  Top 0.305: IC8.4 26.02,23.89 25.4,24.26 25.15,24.26
SW
  Top 0.406: D3.P$1 23.62,11.8 | 23.62,11.8 C13.2 25.27,14.35 | IC2.6 23.62,11.8
  pour Top (no thermals): 20.57,12.06 20.57,10.67 24.64,10.67 24.64,12.19 26.67,12.19 26.67,14.73 22.73,14.73 22.73,12.06
TX
  Top 0.61: J1.2 60.96,48.13
  Bottom 0.61: J5.2 J1.2
VCCIO  (via drill 0.61)
  Top 0.406: v35.69,28.96 35.69,27.69 35.8,27.7 IC1.5 | IC3.5 35.7,23.91 v35.69,25.15
  Top 0.508: R7.1 R6.1 14.61,40.89 15.11,41.53 16.76,41.53 18.67,43.31 21.72,43.31 21.97,43.05 26.04,43.05 26.8,43.81 31.24,43.81 v32.64,42.42
  Top 0.61: C4.1 v36.96,20.57
  Bottom 0.305: 38.61,11.81 38.48,11.56
  Bottom 0.406: J2.2 30.48,5.28 30.5,5.31 | 30.5,6.58 30.48,6.6
  Bottom 0.508: v36.96,20.57 36.96,22.61 35.69,23.88 v35.69,25.15 v35.69,28.96 32.64,32 v32.64,42.42
  Bottom 0.61: POWER.2 J2.2 | 30.5,5.31 30.5,6.58 | 38.48,13.72 38.48,11.56 35.81,8.89 33.91,8.89 32.13,7.11 30.99,7.11 30.48,6.6 | 38.48,13.72 38.48,16.76 36.96,18.29 v36.96,20.57 | SJ1.1 38.48,13.72
VIN  (via drill 0.8)
  Top 0.406: 18.16,7.49 18.29,7.49 | R14.1 45.59,7.87 45.72,7.62
  Top 0.61: R3.1 17.78,7.49 18.16,7.49 18.16,8.26 19.81,10.29 IC2.5
  Top 1.016: POWER.8 J2.8 45.72,7.62 46.86,8.51 46.86,12.32 43.94,15.24 40.26,15.24 39.5,14.48 36.83,14.48 v36.2,13.84 | 17.78,7.49 18.29,7.49 | 18.29,7.49 C12.+ | v18.8,9.65 18.29,7.49
  Bottom 1.016: POWER.8 J2.8 | v36.2,13.84 36.2,12.95 35.94,12.7 34.67,11.56 33.02,11.56 31.11,9.65 v18.8,9.65
  pour Top (no thermals): 19.68,11.68 19.94,11.68 19.94,9.78 19.3,9.02 19.3,5.84 16.89,5.84 16.89,8.51 18.03,9.78 18.03,10.29 19.3,10.29 19.68,10.54

### Text on the board
Bottom: Host USB Rev2